# Altium schematic sheet J-Link ARM-OB.SchDoc
size A4
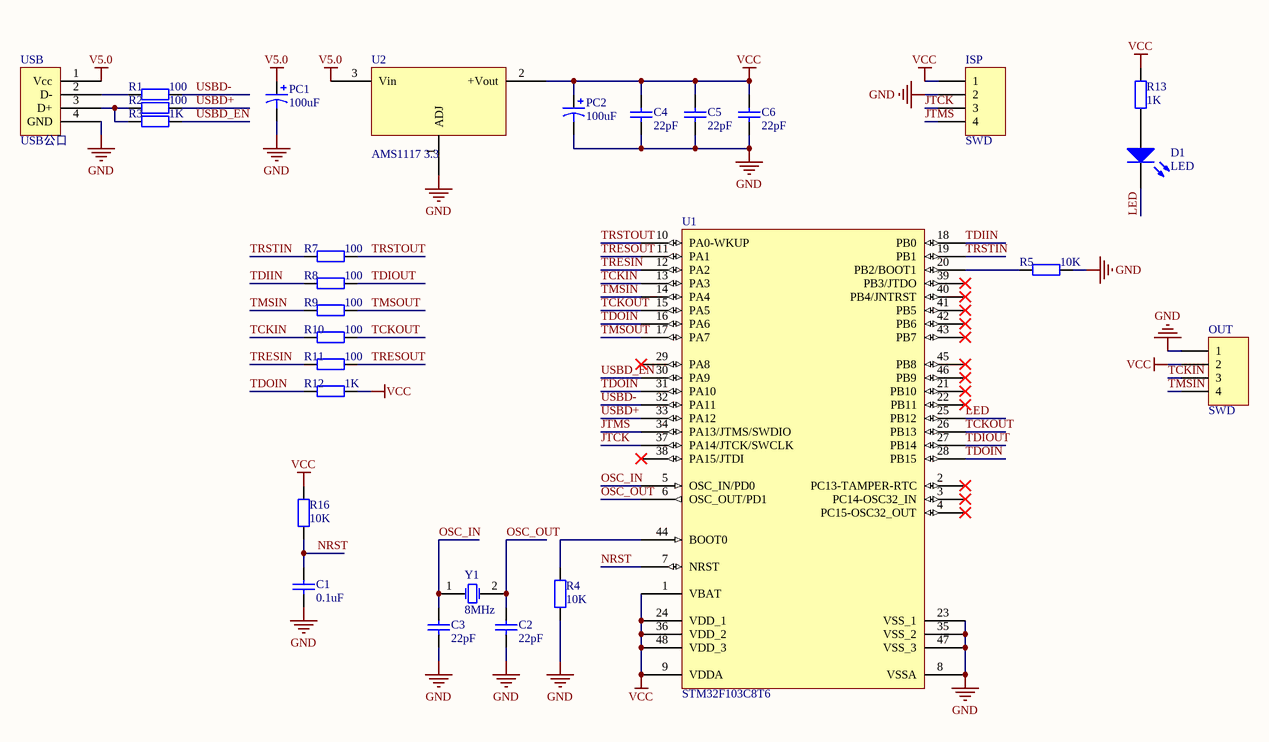
[diagram p0: J-Link ARM-OB.SchDoc]

## Parts
C1  value 0.1uF  [C0603]
C2  value 22pF  [C0603]
C3  value 22pF  [C0603]
C4  value 22pF  [C0603]
C5  value 22pF  [C0603]
C6  value 22pF  [C0603]
D1  LED  [LED0603]
ISP  SWD  [HDR1X4]
OUT  SWD  [HDR1X4]
PC1  value 100uF  [C1206A]
PC2  value 100uF  [C1206A]
R1  value 100  [R0603]
R2  value 100  [R0603]
R3  value 1K  [R0603]
R4  value 10K  [R0603]
R5  value 10K  [R0603]
R7  value 100  [R0603]
R8  value 100  [R0603]
R9  value 100  [R0603]
R10  value 100  [R0603]
R11  value 100  [R0603]
R12  value 1K  [R0603]
R13  value 1K  [R0603]
R16  value 10K  [R0603]
U1  STM32F103C8T6  [LQFP48_N]
U2  AMS1117 3.3  [SOT-223]
USB  USB公口  [USB-H]
Y1  8MHz  [JZ]

## Nets
GND: C1.2 C2.2 C3.2 C4.2 C5.2 C6.2 ISP.2 OUT.1 PC1.2 PC2.2 R4.2 R5.2 U1.8(VSSA) U1.23(VSS_1) U1.35(VSS_2) U1.47(VSS_3) U2.1(ADJ) USB.4(GND)
V5.0: PC1.1 U2.3(Vin) USB.1(Vcc)
VCC: C4.1 C5.1 C6.1 ISP.1 OUT.2 PC2.1 R12.2 R13.2 R16.2 U1.1(VBAT) U1.9(VDDA) U1.24(VDD_1) U1.36(VDD_2) U1.48(VDD_3) U2.2(+Vout)
JTCK: ISP.3 U1.37(PA14/JTCK/SWCLK)
JTMS: ISP.4 U1.34(PA13/JTMS/SWDIO)
LED: D1.2(K) U1.25(PB12)
NRST: C1.1 R16.1 U1.7(NRST)
OSC_IN: C3.1 U1.5(OSC_IN/PD0) Y1.1(OSC1)
OSC_OUT: C2.1 U1.6(OSC_OUT/PD1) Y1.2(OSC2)
TCKIN: OUT.3 R10.1 U1.13(PA3)
TCKOUT: R10.2 U1.15(PA5) U1.26(PB13)
TDIIN: R8.1 U1.18(PB0)
TDIOUT: R8.2 U1.27(PB14)
TDOIN: R12.1 U1.16(PA6) U1.28(PB15) U1.31(PA10)
TMSIN: OUT.4 R9.1 U1.14(PA4)
TMSOUT: R9.2 U1.17(PA7)
TRESIN: R11.1 U1.12(PA2)
TRESOUT: R11.2 U1.11(PA1)
TRSTIN: R7.1 U1.19(PB1)
TRSTOUT: R7.2 U1.10(PA0-WKUP)
USBD+: R2.2 U1.33(PA12)
USBD-: R1.2 U1.32(PA11)
USBD_EN: R3.2 U1.30(PA9)
NetD1_1: D1.1(A) R13.1
NetR1_1: R1.1 USB.2(D-)
NetR2_1: R2.1 R3.1 USB.3(D+)
NetR4_1: R4.1 U1.44(BOOT0)
NetR5_1: R5.1 U1.20(PB2/BOOT1)

Not connected (* = marked no-connect by the designer): U1 2(PC13-TAMPER-RTC)* 3(PC14-OSC32_IN)* 4(PC15-OSC32_OUT)* 21(PB10)* 22(PB11)* 29(PA8)* 38(PA15/JTDI)* 39(PB3/JTDO)* 40(PB4/JNTRST)* 41(PB5)* 42(PB6)* 43(PB7)* 45(PB8)* 46(PB9)*

## Library data of the parts
C1-C6 = Cap: Capacitor; Published: 8-Jun-2000; LatestRevisionDate: 17-Jul-2002; LatestRevisionNote: Re-released for DXP Platform.; PackageReference: RAD-0.3; Publisher: Altium Limited
D1 = LED2: Typical RED, GREEN, YELLOW, AMBER GaAs LED; Published: 8-Jun-2000; LatestRevisionDate: 17-Jul-2002; LatestRevisionNote: Re-released for DXP Platform.; PackageVersion: Feb-2002; PackageReference: 3.2X1.6X1.1; Publisher: Altium Limited
ISP OUT = Header 4: Header, 4-Pin; LatestRevisionDate: 17-Jul-2002; LatestRevisionNote: Re-released for DXP Platform.; Publisher: Altium Limited
PC1 PC2 = Cap Pol3: Polarized Capacitor (Surface Mount); Published: 8-Jun-2000; LatestRevisionDate: 29-May-2009; LatestRevisionNote: IPC-7351 Footprint Added.; PackageReference: C0805; Publisher: Altium Limited; PackageDescription: Chip Capacitor
R1-R5 R7-R13 R16 = Res2: Resistor; Published: 8-Jun-2000; LatestRevisionDate: 17-Jul-2002; LatestRevisionNote: Re-released for DXP Platform.; PackageReference: AXIAL-0.4; Publisher: Altium Limited
U1 = STM32F103C8T6: STM32 ARM-based 32-bit MCU with 64 Kbytes Flash, 48-pin LQFP, Industrial Temperature; Published: 30-May-2008; DatasheetVersion: rev6, Mar-2008; PackageVersion: Mar-2008; PackageReference: LQFP48; Publisher: Altium Limited; PackageDescription: 48-Pin Low-Profile Quad Flat Pack, 7 x 7 mm Body, 0.5 mm Pitch (LQFP48); ComponentLink1Description: Manufacturer Link; ComponentLink1URL: www.st.com/stm32; ComponentLink2Description: Datasheet; ComponentLink2URL: http://www.st.com/stonline/products/literature/ds/13587.pdf
U2 = LM117T
USB = US
Y1 = XTAL: Crystal Oscillator; Published: 8-Jun-2000; LatestRevisionDate: 17-Jul-2002; LatestRevisionNote: Re-released for DXP Platform.; PackageReference: R38; Publisher: Altium Limited